# Altium schematic sheet Control Board.schdoc
size 199 x 155 mm
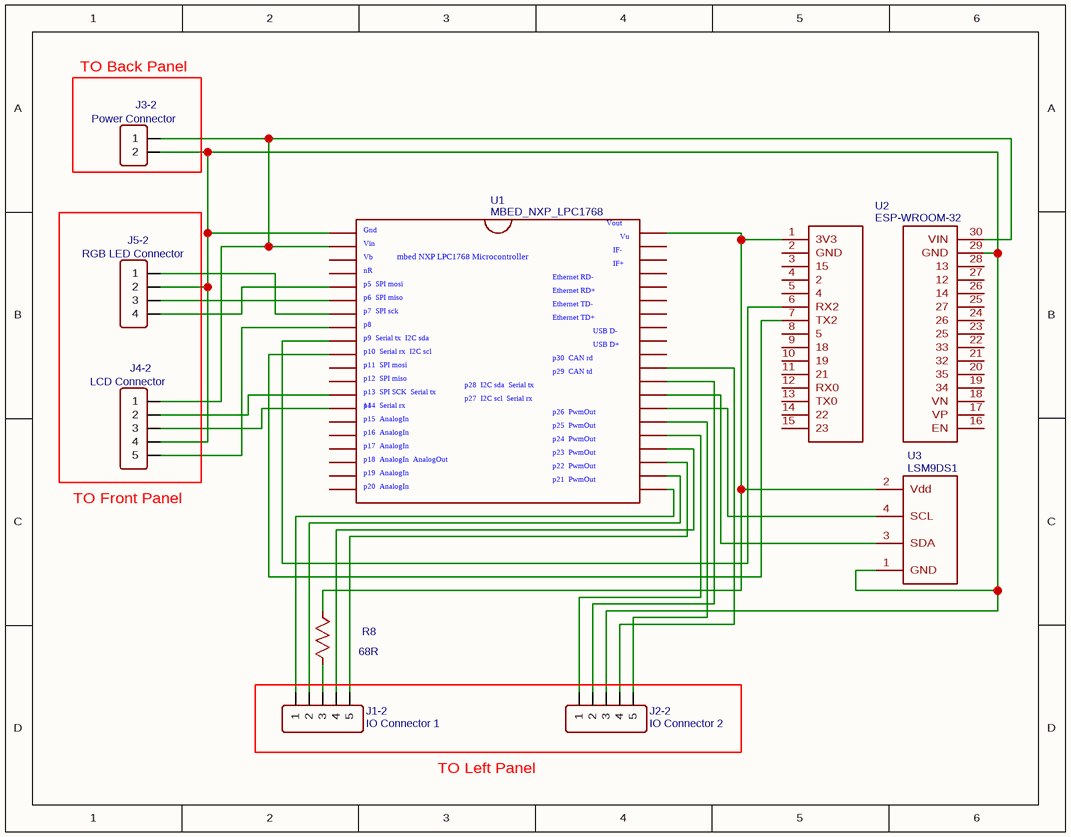
[diagram p0: Control Board.schdoc]

## Parts
J1-2  IO Connector 1  [HDR-M-2.54_1X5]
J2-2  IO Connector 2  [HDR-M-2.54_1X5]
J3-2  Power Connector  [HDR-M-2.54_1X2]
J4-2  LCD Connector  [HDR-M-2.54_1X5]
J5-2  RGB LED Connector  [HDR-M-2.54_1X4]
R8  68R  [R0603]
U1  MBED_NXP_LPC1768  [DIL40_0.9]
U2  ESP-WROOM-32  [ESP-WROOM-32]
U3  LSM9DS1

## Blocks framed on the sheet
TO Back Panel: J3-2

## Nets
NetJ1-2_1: J1-2.1(5) U1.23(P$23)
NetJ1-2_2: J1-2.2(4) U1.24(P$24)
NetJ1-2_3: J1-2.3 R8.1
NetJ1-2_4: J1-2.4(2) U1.22(P$22)
NetJ1-2_5: J1-2.5(1) U1.21(P$21)
NetJ2-2_1: J2-2.1(5) U1.26(P$26)
NetJ2-2_2: J2-2.2(4) U1.30(P$30)
NetJ2-2_3: J2-2.3 J3-2.1(2) J4-2.2(4) J5-2.3(2) U1.1(P$1) U2.29(GND) U3.1(GND)
NetJ2-2_4: J2-2.4(2) U1.29(P$29)
NetJ2-2_5: J2-2.5(1) U1.25(P$25)
NetJ3-2_2: J3-2.2(1) J4-2.5(1) U1.2(P$2) U2.30(VIN)
NetJ4-2_1: J4-2.1(5) U1.8(P$8)
NetJ4-2_3: J4-2.3 U1.14(P$14)
NetJ4-2_4: J4-2.4(2) U1.13(P$13)
NetJ5-2_1: J5-2.1(4) U1.5(P$5)
NetJ5-2_2: J5-2.2(3) U1.6(P$6)
NetJ5-2_4: J5-2.4(1) U1.7(P$7)
NetR8_2: R8.2 U1.40(P$40) U2.1(3V3) U3.2(Vdd)
NetU1_9: U1.9(P$9) U2.6(RX2)
NetU1_10: U1.10(P$10) U2.7(TX2)
NetU1_27: U1.27(P$27) U3.4(SCL)
NetU1_28: U1.28(P$28) U3.3(SDA)

Not connected (* = marked no-connect by the designer): U1 3(P$3) 4(P$4) 11(P$11) 12(P$12) 15(P$15) 16(P$16) 17(P$17) 18(P$18) 19(P$19) 20(P$20) 31(P$31) 32(P$32) 33(P$33) 34(P$34) 35(P$35) 36(P$36) 37(P$37) 38(P$38) 39(P$39); U2 2(GND) 3(15) 4(2) 5(4) 8(5) 9(18) 10(19) 11(21) 12(RX0) 13(TX0) 14(22) 15(23) 16(EN) 17(VP) 18(VN) 19(34) 20(35) 21(32) 22(33) 23(25) 24(26) 25(27) 26(14) 27(12) 28(13)

## Notes on the sheet
- (near J4-2) TO Front Panel
- TO Left Panel
- (in symbol MBED_NXP_LPC1768) Vout; Gnd; Vu; Vin; IF-; Vb; mbed NXP LPC1768 Microcontroller; IF+; nR; Ethernet RD-; p5  SPI mosi; Ethernet RD+; p6  SPI miso; Ethernet TD-; p7  SPI sck; Ethernet TD+; p8; USB D-; p9  Serial tx  I2C sda; USB D+; p10  Serial rx  I2C scl; p30  CAN rd; p11  SPI mosi; p29  CAN td; p12  SPI miso; p28  I2C sda  Serial tx; p13  SPI SCK  Serial tx; p27  I2C scl  Serial rx; p14  Serial rx; p26  PwmOut; p15  AnalogIn; p25  PwmOut; p16  AnalogIn; p24  PwmOut; p17  AnalogIn; p23  PwmOut; p18  AnalogIn  AnalogOut; p22  PwmOut; p19  AnalogIn; p21  PwmOut; p20  AnalogIn

## Library data of the parts
J1-2 = IO Connector 1: Contributor: LCEDA_Lib; BOM_Supplier Part: C358687; BOM_Supplier: LCSC; spicePre: J; spiceSymbolName: HDR-M-2.54_1x5
J2-2 = IO Connector 2: Contributor: LCEDA_Lib; BOM_Supplier Part: C358687; BOM_Supplier: LCSC; spicePre: J; spiceSymbolName: HDR-M-2.54_1x5
J3-2 = Power Connector: Contributor: LCEDA_Lib; BOM_Supplier Part: C124375; BOM_Supplier: LCSC; spicePre: J; spiceSymbolName: HDR-M-2.54_1x2
J4-2 = LCD Connector: Contributor: LCEDA_Lib; BOM_Supplier Part: C358687; BOM_Supplier: LCSC; spicePre: J; spiceSymbolName: HDR-M-2.54_1x5
J5-2 = RGB LED Connector: Contributor: LCEDA_Lib; BOM_Supplier Part: C124378; BOM_Supplier: LCSC; spicePre: J; spiceSymbolName: HDR-M-2.54_1x4
R8 = 68R: nameAlias: Value(Ω); Contributor: LCEDA_Lib; spicePre: R; spiceSymbolName: R_0603_US
U1 = MBED_NXP_LPC1768: Contributor: SparkFun; spicePre: U; spiceSymbolName: MBED_NXP_LPC1768
U2 = ESP-WROOM-32: Contributor: rdear; spicePre: U; spiceSymbolName: ESP-WROOM-32
U3 = LSM9DS1: Contributor: tcirineo; timeStamp: 1476583709; spicePre: U; spiceSymbolName: 9DOF Sensor Stick